# EAGLE design TLV70433 (EAGLE 7.1.0)
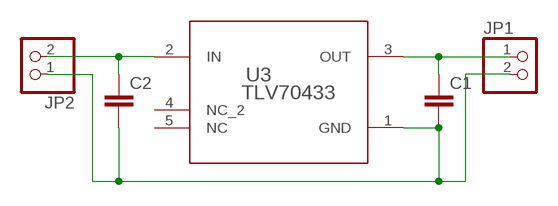
[diagram p0: schematic, sheet 1]

## Parts
C1  C-EUC1206  [C1206]
C2  C-EUC1206  [C1206]
JP1  PINHD-1X2  [1X02]
JP2  PINHD-1X2  [1X02]
U3  TLV70433  TLV70430DBVR  [DBV0005A_N]

## Nets
GND: C1.2 C2.2 JP1.2 JP2.1 U3.1(GND)
VIN: C2.1 JP2.2 U3.2(IN)
VOUT: C1.1 JP1.1 U3.3(OUT)
Unconnected: U3.4(NC_2) U3.5(NC)

## Library data of the parts
C1 C2 = rcl:C-EU: CAPACITOR, European symbol
JP1 JP2 = pinhead:PINHD-1X2: PIN HEADER
U3 = si5351:TLV70430DBVR; MANUFACTURER: Texas Instruments; PARTNUMBER: TLV70430DBVR; REFDES: RefDes; TYPE: TYPE; VALUE: Value

## Board
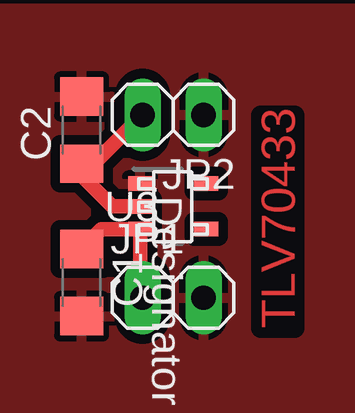
[diagram p1: board, top side]

No outline drawn. Coordinates in mm, seen from the top.
Copper layers (1*16): Top 0.035mm / dielectric 1.5mm / Bottom 0.035mm
Design rules "default": minimum track width 10mil, minimum drill 24mil, track to track 8mil, track to pad 8mil, pad to pad 8mil, via to via 8mil, smd to smd 8mil, copper to edge 40mil, drill to drill 8mil, minimum pad ring 10mil, minimum via ring 8mil, stop-mask expansion 4mil, vias tented up to drill 0mil, thermal gap 10mil

### Footprints (pad centres in the part's own frame; a part is rotated, then mirrored left to right if it is on the bottom)
C1206 = smd 1.6 x 1.8: 1 -1.4,0; 2 1.4,0
1X02 = drill 1.016 long: 1 -1.27,0; 2 1.27,0
DBV0005A_N = smd 1 x 0.6: 1 -1.375,0.95; 2 -1.375,0; 3 -1.375,-0.95; 4 1.375,-0.95; 5 1.375,0.95

### Placement (x,y rotation side)
C1  -25.4,5.71 270 top
C2  -25.4,12.06 90 top
JP1  -21.59,5.08 0 top
JP2  -21.59,12.7 180 top
U3  -21.59,8.89 0 top

### Tracks (layer width: path | path; a pad name or v marks a point on that pad's centre or on a via)
GND
  pour Top (isolate 0.406): -32.38,17.14 -13.97,17.14 -13.97,-0.64 -32.38,-0.64
VIN
  Top 0.61: U3.2 -24.13,8.89 -25.4,10.16 C2.1 -24.89,10.66 JP2.2
VOUT
  Top 0.61: JP1.1 -22.96,5.18 U3.3 -24.57,7.94 C1.1

### Text on the board
Top: TLV70433